# EAGLE design EEZ AUX PS r4B40 (EAGLE 6.1)
Assembly variants: Farnell, TME
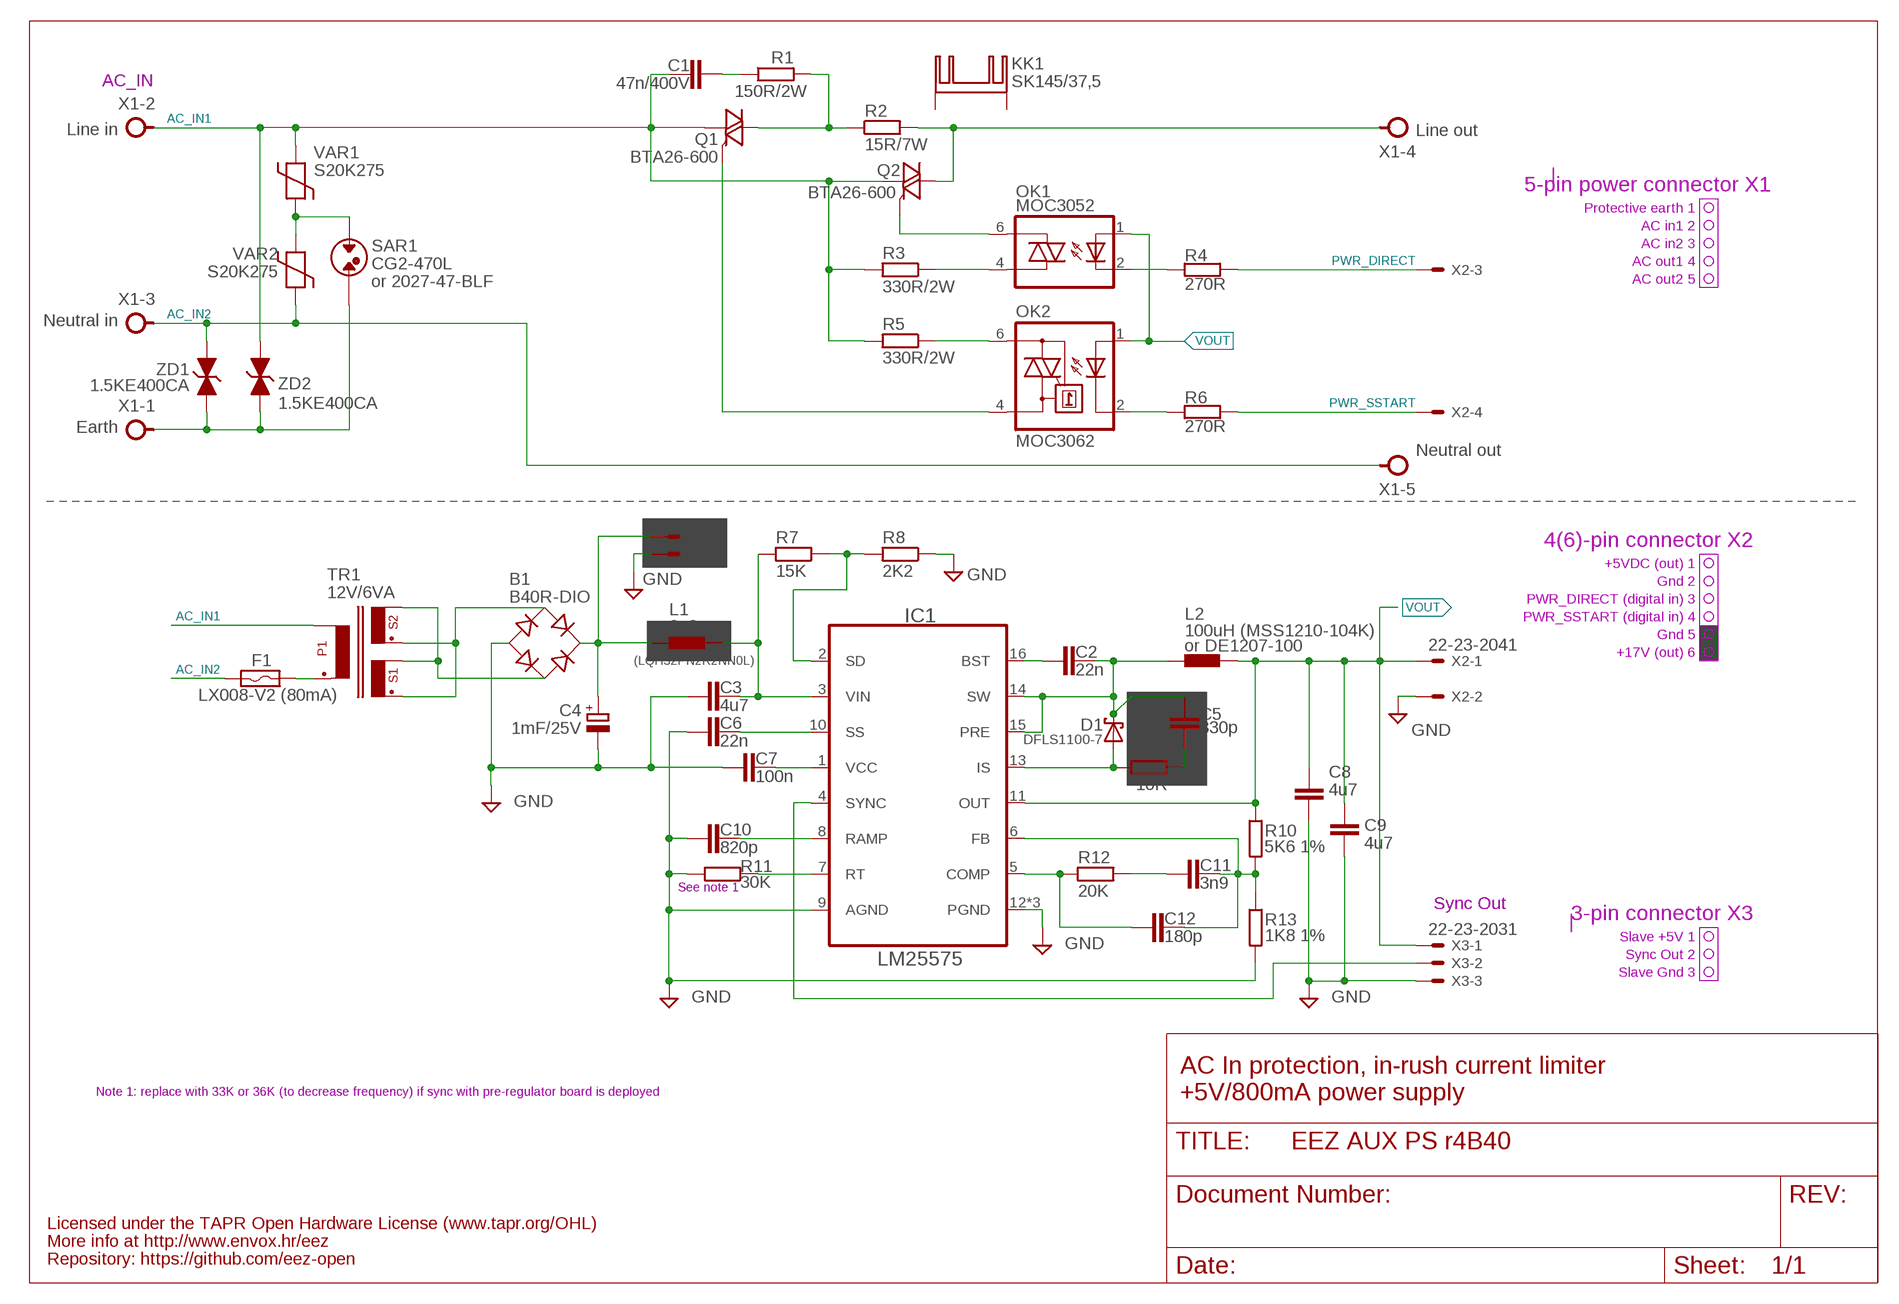
[diagram p0: schematic, sheet 1]

## Parts
B1  B40R-DIO  RECTIFIER-RB1A  [RB1A]
C1  47n/400V  C-EU075-052X106  [C075-052X106]
C2  22n  C-EUC0805  [C0805]
C3  4u7  C-EUC1210  [C1210]
C4  1mF/25V  ECAP5G_10.5MM  [ECAP5/10.5]
C5  330p  C-EUC0805  [C0805]
C6  22n  C-EUC0805  [C0805]
C7  100n  C-EUC0805  [C0805]
C8  4u7  C-EUC1210  [C1210]
C9  4u7  C-EUC1210  [C1210]
C10  820p  C-EUC0805  [C0805]
C11  3n9  C-EUC0805  [C0805]
C12  180p  C-EUC0805  [C0805]
D1  DFLS1100-7  SCHOTTKYSOD123  [SOD123]
F1  LX008-V2 (80mA)  FUSE_RESETTABLER7  [POLYSWITCH-R7]
IC1  LM25575  LM(2)5575  [SOP65P640X110-17N_HOLE]
KK1  SK145/37,5  SK145  [SK145]
L1  2u2  L1210  [L1210]
L2  100uH (MSS1210-104K)  COILCRAFT_MSS1278  [MSS1278]
OK1  MOC3052  MOC305X  [DIL6-SMD]
OK2  MOC3062  MOC3033S  [DIL6-SMD]
Q1  BTA26-600  BTA26-V  [TOP3S-1]
Q2  BTA26-600  BTA26-V  [TOP3S-1]
R1  150R/2W  R-EU_R2512  [R2512]
R2  15R/7W  R_EU7W  [R_0913]
R3  330R/2W  R-EU_R2512  [R2512]
R4  270R  R-EU_R0805  [R0805]
R5  330R/2W  R-EU_R2512  [R2512]
R6  270R  R-EU_R0805  [R0805]
R7  15K  R-EU_R0805  [R0805]
R8  2K2  R-EU_R0805  [R0805]
R9  10R  R-EU_R1206  [R1206]
R10  5K6 1%  R-EU_R0805  [R0805]
R11  30K  R-EU_R0805  [R0805]
R12  20K  R-EU_R0805  [R0805]
R13  1K8 1%  R-EU_R0805  [R0805]
SAR1  CG2-470L  SAR  [SAR]
TR1  12V/6VA  PCB_TRAFO6VACOMBO  [PCB_TRAFO6VA_DUAL]
VAR1  S20K275  VARISTOR  [VARISTOR]
VAR2  S20K275  VARISTOR  [VARISTOR]
X1  AC_IN  TBLOCK5.0_5A  [TBLOCK5.0_5]
X2  22-23-2041  22-23-2061  [22-23-2061]
X3  22-23-2031  [22-23-2031]
ZD1  1.5KE400CA  1.5KE-BIDIR  [DO201-BIDIR]
ZD2  1.5KE400CA  1.5KE-BIDIR  [DO201-BIDIR]

## Nets
AC_EARTH: SAR1.P$2 X1.1 ZD1.C ZD2.C
AC_IN1: C1.2 Q1.A1 Q2.A1 R3.2 R5.2 TR1.NC1(P1) TR1.P1 TR1.P1.1(P1) TR1.P1.2(P1) VAR1.P$2 X1.2 ZD2.A
AC_IN2: F1.P$1 VAR2.P$1 X1.3 X1.5 ZD1.A
DC_PREG1: C3.1 IC1.3(VIN) L1.2 R7.2
GND [gnd]: B1.- C3.2 C4.- C6.2 C7.1 C8.2 C9.2 C10.1 IC1.9(AGND) IC1.12(PGND) IC1.TP2(PGND) IC1.TP(PGND) R8.1 R11.2 R13.2 X2.2 X2.5 X3.3
IS: D1.A IC1.13(IS) R9.1
N$1: C5.2 R9.2
N$2: OK1.6(A2) Q2.G
N$3: OK1.4(A1) R3.1
N$4: OK2.4(A1) Q1.G
N$5: OK1.2(C) R4.1
N$6: OK2.2(C) R6.1
N$7: OK2.6(A2) R5.1
N$8: Q2.A2 R2.2 X1.4
N$13: IC1.4(SYNC) X3.2
N$15: C1.1 R1.1
N$16: Q1.A2 R1.2 R2.1
N$40: B1.AC2 TR1.S1.2 TR1.S1.2A(S1.2) TR1.S1.2NC(S1.2) TR1.S2.2
N$77: C11.2 R12.2
N$114: SAR1.P$1 VAR1.P$1 VAR2.P$2
N$128: C11.1 C12.1 IC1.6(FB) R10.2 R13.1
N$131: C2.2 IC1.16(BST)
N$135: C12.2 IC1.5(COMP) R12.1
N$141: B1.AC1 TR1.S1.1 TR1.S2.1 TR1.S2.1A(S2.1)
N$162: F1.P$2 TR1.P2 TR1.P2.1(P2) TR1.P2.2(P2)
N$165: IC1.7(RT) R11.1
N$166: C7.2 IC1.1(VCC)
N$167: C10.2 IC1.8(RAMP)
N$168: C6.1 IC1.10(SS)
N$180: IC1.2(SD) R7.1 R8.2
PWR_DIRECT: R4.2 X2.3
PWR_SSTART: R6.2 X2.4
SW: C2.1 C5.1 D1.C IC1.14(SW) IC1.15(PRE) L2.1
VIN: B1.+ C4.+ L1.1 X2.6
VOUT: C8.1 C9.1 IC1.11(OUT) L2.2 OK1.1(A) OK2.1(A) R10.1 X2.1 X3.1
Unconnected: KK1.1(K) KK1.2(K)

## Notes on the sheet
- Line in
- Line out
- 5-pin power connector X1
- Protective earth 1
- AC in1 2
- AC in2 3
- AC out1 4
- AC out2 5
- or 2027-47-BLF
- Neutral in
- Earth
- Neutral out
- 4(6)-pin connector X2
- +5VDC (out) 1
- Gnd 2
- PWR_DIRECT (digital in) 3
- PWR_SSTART (digital in) 4
- Gnd 5
- +17V (out) 6
- or DE1207-100
- (LQH32PN2R2NN0L)
- See note 1
- Sync Out | 3-pin connector X3
- Slave +5V 1
- Sync Out 2
- Slave Gnd 3
- AC In protection, in-rush current limiter
- Note 1: replace with 33K or 36K (to decrease frequency) if sync with pre-regulator board is deployed
- +5V/800mA power supply
- Licensed under the TAPR Open Hardware License (www.tapr.org/OHL)
- More info at http://www.envox.hr/eez
- Repository: https://github.com/eez-open

## Library data of the parts
B1 = rectifier:RECTIFIER-: Rectifier
C1-C3 C5-C12 = rcl:C-EU: CAPACITOR, European symbol
C4 = EEZ_Lib1:ECAP
D1 = EEZ_Lib1:SCHOTTKY
F1 = EEZ_Lib1:FUSE_RESETTABLE
IC1 = EEZ_Lib1:LM(2)5575: Simple Switcher® 42V, 1.5A Step-Down Switching Regulator
KK1 = EEZ_Lib1:SK145: FISCHER ELEKTRONIK SK 145/37,5 STS-220 Heat Sink, TO-220, TO-218, TO-220, TO-247, TO-248, 12 °C/W, 29 mm, 12 mm
L1 = EEZ_Lib1:L1210
L2 = EEZ_Lib1:COILCRAFT_MSS1278: Coilcraft SMT Power Inductors – MSS1278
OK1 = EEZ_Lib1:MOC305X: 6-pin DIP Random-phase Optoisolators Triac Drivers (600V Peak)
OK2 = optocoupler:MOC30*: 6-Pin DIP Zero-Cross Optoisolators Triac Driver Output (250/400 Volt Peak) Source: http://www.fairchildsemi.com/ds/MO/MOC3043-M.pdf; MF: FAIRCHILD SEMICONDUCTOR; MPN: MOC3033S-M; OC_FARNELL: unknown; OC_NEWARK: 05C2878
Q1 Q2 = triac:BTA26: 25A TRIAC Source: http://www.st.com/stonline/products/literature/ds/7470.pdf
R1 R3-R13 = rcl:R-EU_: RESISTOR, European symbol
R2 = EEZ_Lib1:R_EU: RESISTOR - European symbol
SAR1 = EEZ_Lib1:SAR: EPCOS surge arrester EF470X Farnell: 1886596
TR1 = EEZ_Lib1:PCB_TRAFO6VA: TEZ 6VA transformer for PCB
VAR1 VAR2 = MyLib:VARISTOR: EPCOS - B72220S0251K101 - VARISTOR, 140J, 250VAC Farnell: 1004357
X1 = EEZ_Lib1:TBLOCK5.0_5A
X2 = con-molex:22-23-2061: .100" (2.54mm) Center Header - 6 Pin; MF: MOLEX; MPN: 22-23-2061; OC_FARNELL: 1462922; OC_NEWARK: 27C1933
X3 = con-molex:22-23-2031: .100" (2.54mm) Center Header - 3 Pin; MF: MOLEX; MPN: 22-23-2031; OC_FARNELL: 1462950; OC_NEWARK: 30C0862
ZD1 ZD2 = EEZ_Lib1:1.5KE-BIDIR

## Net classes
0 default: width 0.254 mm, drill 0.584 mm
2 gnd: width 0.254 mm, drill 0.584 mm, clearance 0.254 mm

## Board
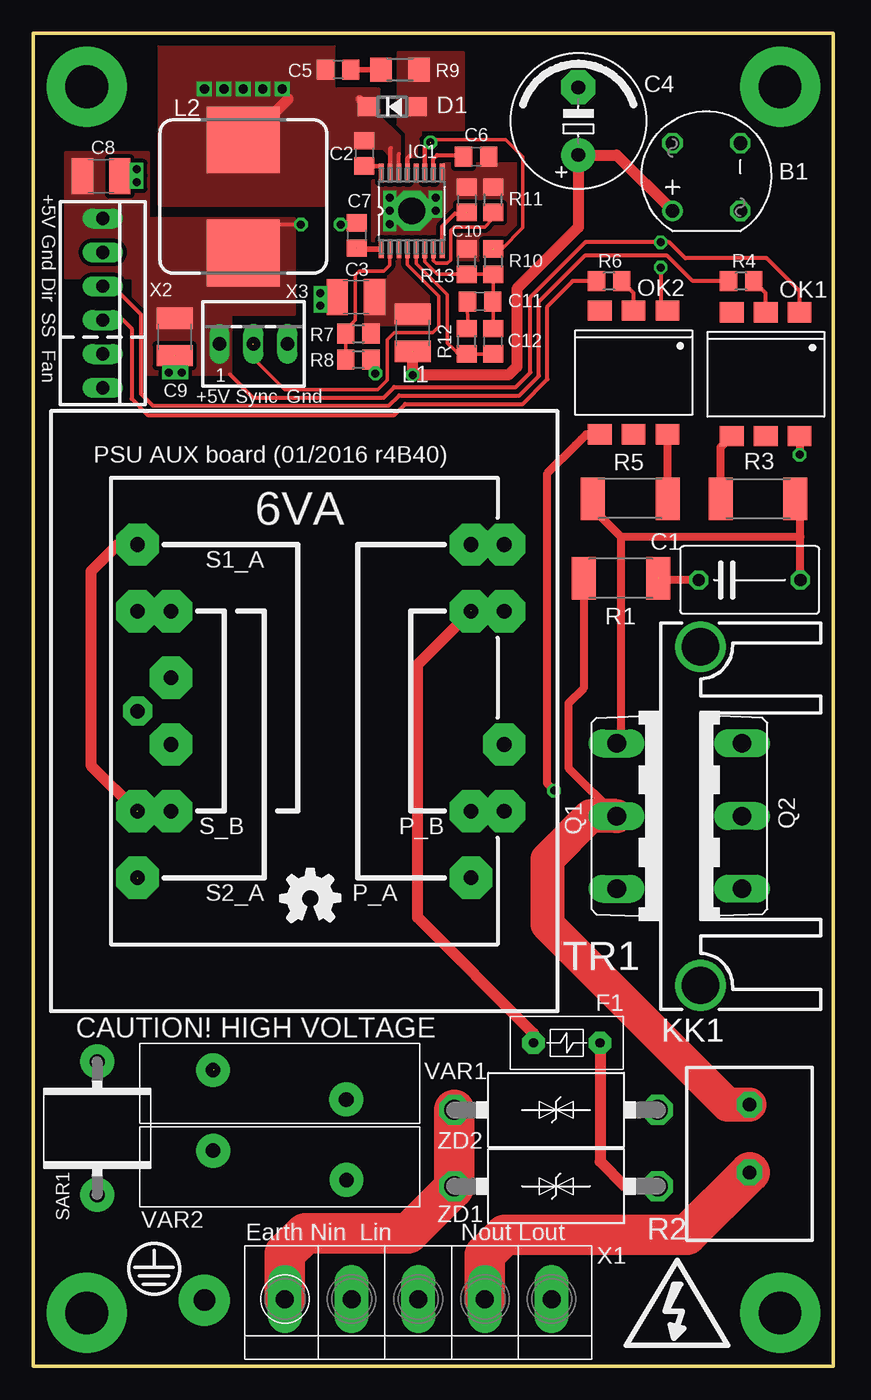
[diagram p1: board, top side]
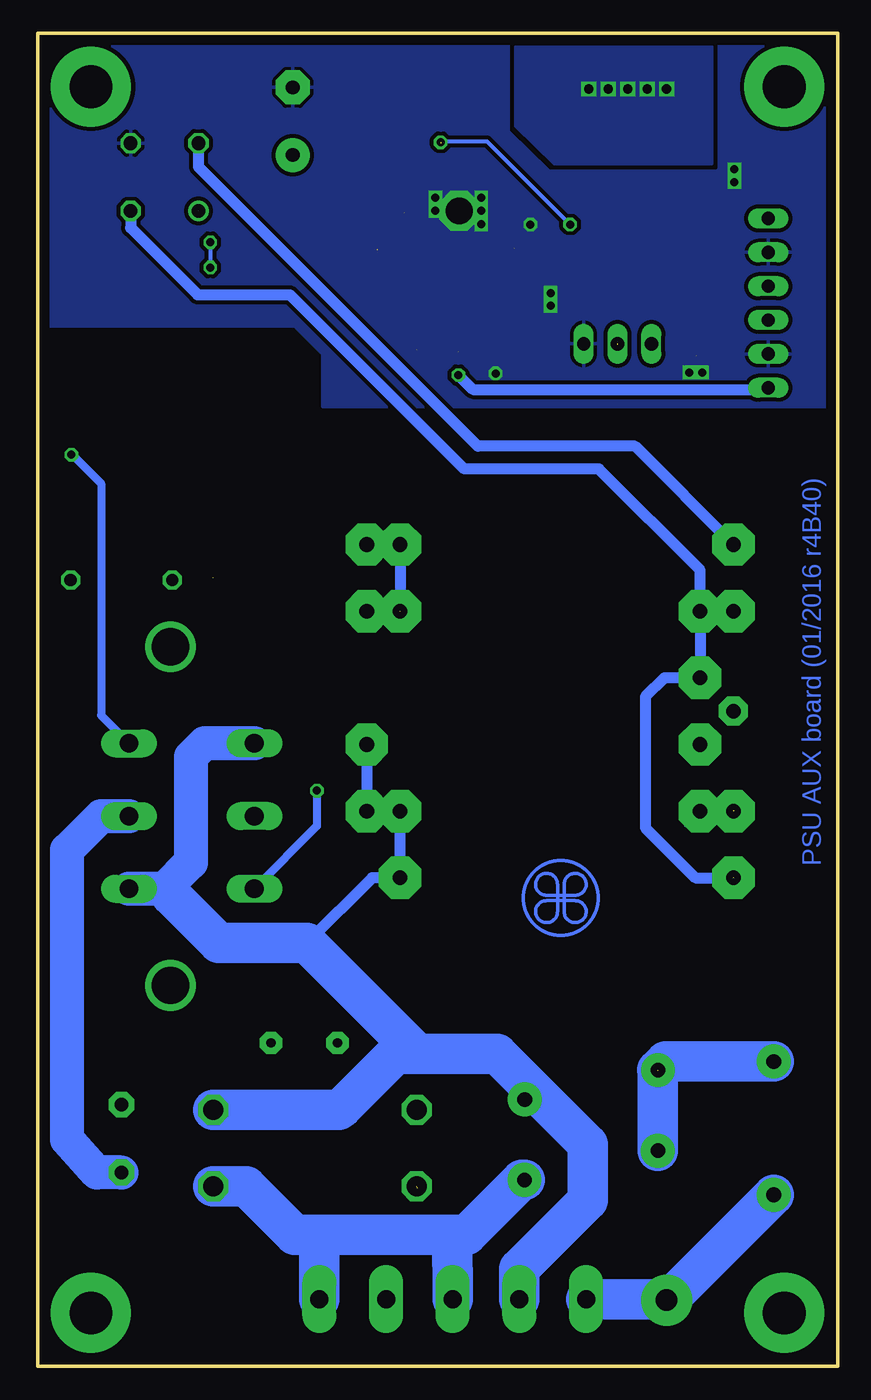
[diagram p2: board, bottom side, seen from below]

Size 60 x 100 mm. Coordinates in mm from the lower left corner, seen from the top.
Outline: 0,0 0,100 60,100 60,0 0,0
Copper layers (1+5*16): Top 0.035mm / dielectric 0.75mm / Route5 0.035mm / dielectric 0.75mm / Bottom 0.035mm
Design rules: minimum track width 10mil, minimum drill 0.5mm, track to track 8mil, track to pad 8mil, pad to pad 8mil, via to via 8mil, smd to smd 8mil, copper to edge 30mil, drill to drill 8mil, minimum pad ring 10mil, minimum via ring 8mil, stop-mask expansion 0mil, vias tented up to drill 25mil, thermal gap 10mil

### Footprints (pad centres in the part's own frame; a part is rotated, then mirrored left to right if it is on the bottom)
RB1A = drill 1.016: + -2.54,2.54 | drill 1.016 octagon: - 2.54,-2.54; AC1 2.54,2.54; AC2 -2.54,-2.54
C075-052X106 = drill 0.914 octagon: 1 -3.81,0; 2 3.81,0
C0805 = smd 1.3 x 1.5: 1 -0.95,0; 2 0.95,0
C1210 = smd 1.6 x 2.7: 1 -1.4,0; 2 1.4,0
ECAP5/10.5 = drill 1.016 pad 2.54: + -2.54,0 | drill 1.016 pad 2.54 octagon: - 2.54,0
SOD123 = smd 1.4 x 1.4: A 1.9,0; C -1.9,0
POLYSWITCH-R7 = drill 0.7 pad 1.676 octagon: P$1 -2.5,0; P$2 2.5,0
SOP65P640X110-17N_HOLE = smd 1.422 x 0.356: 1 -2.845,2.286; 2 -2.845,1.626; 3 -2.845,0.965; 4 -2.845,0.33; 5 -2.845,-0.33; 6 -2.845,-0.965; 7 -2.845,-1.626; 8 -2.845,-2.286; 9 2.845,-2.286; 10 2.845,-1.626; 11 2.845,-0.965; 12 2.845,-0.33; 13 2.845,0.33; 14 2.845,0.965; 15 2.845,1.626; 16 2.845,2.286 | smd 2.032 x 2.032: TP 0,0 | drill 2 octagon: TP2 0,0
SK145 = drill 2.8: 1 -12.7,0; 2 12.7,0
L1210 = smd 1.6 x 2.7: 1 -1.4,0; 2 1.4,0
MSS1278 = smd 5.5 x 5: 1 0,4.25; 2 0,-4.25
DIL6-SMD = smd 1.78 x 1.52: 1 -2.54,-4.645; 2 0,-4.645; 3 2.54,-4.645; 4 2.54,4.645; 5 0,4.645; 6 -2.54,4.645
TOP3S-1 = drill 1.397 long: A1 -5.461,-3.175; A2 0,-3.175; G 5.461,-3.175
R2512 = smd 1.8 x 3.2: 1 -2.8,0; 2 2.8,0
R_0913 = drill 1.016 pad 1.93 octagon: 1 -3.556,0; 2 1.524,0
R0805 = smd 1.3 x 1.5: 1 -0.95,0; 2 0.95,0
R1206 = smd 1.6 x 1.803: 1 -1.422,0; 2 1.422,0
SAR = drill 1.1 pad 2.54: P$1 0,0; P$2 10,0
PCB_TRAFO6VA_DUAL = drill 1.1 pad 3.175 octagon: NC1 -15,2.5; NC2 -15,-12.5; NC4 10,2.5; P1 -12.5,12.5; P1.1 -12.5,7.5; P1.2 -15,7.5; P2 -12.5,-12.5; P2.1 -12.5,-7.5; P2.2 -15,-7.5; S1.1 12.5,-12.5; S1.2 12.5,-7.5; S1.2A 10,-2.5; S1.2NC 10,-7.5; S2.1 12.5,7.5; S2.1A 10,7.5; S2.2 12.5,12.5 | drill 1.1 pad 2.184 octagon: NC3 12.5,0
VARISTOR = drill 1.1 pad 2.54: P$1 0,0; P$2 10,-2.2
TBLOCK5.0_5 = drill 1.35 pad 2.54 long: 1 0,0; 2 0,-5; 3 0,-10; 4 0,-15; 5 0,-20
22-23-2061 = drill 1 long: 1 -6.35,0; 2 -3.81,0; 3 -1.27,0; 4 1.27,0; 5 3.81,0; 6 6.35,0
22-23-2031 = drill 1 long: 1 -2.54,0; 2 0,0; 3 2.54,0
DO201-BIDIR = drill 1.499 octagon: A 7.62,0; C -7.62,0

### Placement (x,y rotation side)
B1  50.48,89.22 90 top
C1  53.72,58.99 0 top
C2  24.83,91 270 top
C3  24.19,80.2 180 top
C4  40.87,93.41 90 top
C5  22.86,97.28 0 top
C6  33.21,90.74 0 top
C7  24.26,84.84 270 top
C8  5.08,89.28 0 top
C9  10.6,77.22 270 top
C10  32.51,87.5 270 top
C11  33.5,79.88 180 top
C12  34.48,76.9 270 top
D1  26.92,94.49 0 top
EEZ_SIGNATURE  SIGNATURESMALL  [SIGNATURE_5MM]  20.76,35.13 180 top
F1  40.01,24.26 180 top
IC1  28.38,86.68 90 top
KK1  50.04,41.27 270 top
L1  28.45,77.53 90 top
L2  100uH (MSS1260-104K)  [MSS1278]  15.75,87.76 0 top
OK1  54.93,74.42 180 top
OK2  45.02,74.55 180 top
Q1  46.93,41.27 270 top
Q2  49.97,41.27 90 top
R1  44.07,59.12 180 top
R2  53.72,16.07 270 top
R3  54.36,65.09 0 top
R4  53.09,81.41 180 top
R5  44.77,65.09 180 top
R6  43.18,81.41 180 top
R7  24.38,77.47 0 top
R8  24.38,75.5 180 top
R9  27.5,97.28 180 top
R10  34.48,82.87 270 top
R11  34.48,87.5 90 top
R12  32.51,76.9 90 top
R13  32.51,82.87 90 top
SAR1  4.79,22.86 270 top
TR1  20.32,49.15 180 top
VAR1  13.47,22.21 0 top
VAR2  23.49,13.97 180 top
X1  18.87,5.03 90 top
X2  5.21,79.76 270 top
X3  16.51,76.71 0 top
ZD1  39.21,13.5 0 top
ZD2  39.21,19.23 0 top

### Tracks (layer width: path | path; a pad name or v marks a point on that pad's centre or on a via)
AC_EARTH  (via drill 1.6 pad 3.81)  (1 unrouted)
  Top 3.048: ZD1.C ZD2.C | X1.1 18.87,8.46 20.38,9.97 28.13,9.97 31.5,13.34
  Bottom 3.048: X1.1 12.94,5.03 v12.83,4.95 12.7,4.95 SAR1.P$2
AC_IN1
  Top 0.61: C1.2 57.53,62.23 | 57.53,62.23 57.53,64.27 R3.2 | R5.2 41.97,64.33 44.07,62.23 | 44.07,62.23 57.53,62.23 | 44.07,62.23 44.07,47.05 Q1.A1
  Bottom 0.61: 37.4,19.24 37.34,19.24 37.21,19.37
  Bottom 0.813: TR1.NC1 TR1.P1.2 TR1.P1.1 TR1.P1 34.92,36.65 39.81,31.75 | 25.53,23.43 25.34,23.43 22.69,20.79 VAR1.P$2
  Bottom 2.54: Q1.A1 47.5,46.74 48.51,45.72 48.51,37.78 50.48,35.81 | 50.48,35.81 Q2.A1 | 31.62,23.56 31.75,23.43 | 50.48,35.81 49.97,35.31
  Bottom 3.048: X1.2 23.87,7.31 18.73,12.45 18.73,16.64 25.53,23.43 31.75,23.43 33.15,23.43 37.21,19.37 | 37.4,19.24 46.81,19.24 ZD2.A | 31.62,23.56 39.81,31.75 46.42,31.75 49.97,35.31
AC_IN2
  Top 0.813: 45.59,13.5 ZD1.A 44.36,13.5 42.51,15.35 F1.P$1
  Bottom 3.048: ZD1.A 44.36,13.5 40.7,9.84 38.86,9.84 | X1.5 38.87,9.83 38.86,9.84 | 28.89,9.84 27.81,9.84 23.69,13.97 VAR2.P$1 | 28.89,9.84 38.86,9.84 | X1.3 28.89,9.84
DC_PREG1
  pour Top (isolate 0.305, no thermals): 27.37,83.82 27.5,83.82 27.5,82.61 28,82.11 29.21,80.96 29.65,80.58 29.65,78.11 24.89,78.11 24.89,81.53 26.61,81.53 26.61,82.87 27.37,82.87
GND  (via drill 0.6)  (1 unrouted)
  Top 0.254: v21.53,80.52 22.48,80.52 C3.2 | v25.65,74.49 R8.1
  Top 0.305: C7.1 v23.05,85.66 | v10.16,74.55 10.1,75.31 C9.2 | v7.75,88.84 6.99,88.77 C8.2
  other vias: 11.11,74.55 7.75,89.79 26.73,87.68 26.73,86.68 26.73,85.67 21.53,79.57 30.16,87.68 30.16,86.68
  pour Bottom (isolate 0.305, rank 2): 0.51,99.63 59.88,99.63 59.88,78.04 40.7,78.04 38.61,75.95 38.61,72.01 0.51,72.01
  pour Top (isolate 0.305, no thermals): 25.46,88.9 30.8,88.9 30.8,90.17 36.26,90.17 36.26,82.99 31.69,82.99 31.69,84.45 25.46,84.45
IS
  Top 0.356: IC1.13 28.05,90.6 28.26,90.81
  pour Top (isolate 0.305, no thermals): 28,89.79 28,92.52 27.37,93.15 27.37,98.55 32.26,98.55 32.26,92.77 29.02,92.77 29.02,90.74 28.26,90.74 28.13,90.61 28.13,89.79
N$1
  Top 0.406: C5.2 R9.2
N$2  (via drill 0.6)
  Top 0.61: OK1.6 v57.47,68.39
  Bottom 0.61: v57.47,68.39 57.4,68.39 55.24,66.23 55.24,48.83 Q2.G
N$3
  Top 0.508: 52.32,69.71 OK1.4
  Top 0.61: R3.1 51.56,68.94 OK1.4
N$4  (via drill 0.6)
  Top 0.61: v39.05,43.18 38.54,43.69 38.54,66.99 40.67,69.12 41.08,69.53 41.46,69.9 OK2.4
  Bottom 0.61: v39.05,43.18 39.05,40.51 Q1.G
N$5
  Top 0.305: OK1.2 54.93,80.52 R4.1
N$6
  Top 0.305: OK2.2 45.02,80.52 R6.1
N$7
  Top 0.61: R5.1 OK2.6
N$8
  Top 3.048: X1.4 33.87,8.34 35.37,9.84 49.02,9.84 R2.2
  Bottom 2.54: R2.2 55.56,14.54 57.78,17.02 57.78,38.73 55.24,41.27 Q2.A2
N$13  (1 unrouted)
  Top 0.254: 28.07,83.83 IC1.4 28.05,82.63 30.42,80.26 30.42,77.98 29.97,77.53 27.05,77.53 26.54,77.03 26.54,73.98 25.84,73.28 18.86,73.28 16.51,75.63 16.51,76.64
N$15  (1 unrouted)
  Top 0.61: C1.1 46.67,58.99 | 46.61,58.99 46.67,58.99 | 46.67,58.99 46.86,59.18
N$16
  Top 0.61: R1.2 41.27,50.86 40.13,49.72 40.13,44.9 Q1.A2
  Top 2.54: Q1.A2 41.78,41.27 38.54,38.04 38.54,33.15 52.07,19.62 R2.1
N$40  (1 unrouted)
  Bottom 0.813: TR1.S1.2 TR1.S1.2NC | TR1.S1.2NC TR1.S1.2A 12.99,51.65 14.41,50.23 14.41,40.39 10.67,36.64 TR1.S2.2 | TR1.S2.2 | TR1.S1.2NC 10.32,59.72 17.91,67.31 28,67.31 41.08,80.39 48.01,80.39 53.02,85.41 B1.AC2
N$77
  Top 0.254: C11.2 32.58,78.04 R12.2
N$114  (1 unrouted)
  Bottom 3.048: SAR1.P$1 12.88,22.87 13.53,22.23 | VAR2.P$2 13.49,22.2 VAR1.P$1
N$128
  Top 0.254: IC1.6 29.35,82.86 30.29,81.92 R13.1 R10.2 34.48,80.08 C11.1 34.48,79.94 C12.1
N$131
  Top 0.356: C2.2 26.03,90.05 26.1,89.98 IC1.16
N$135  (1 unrouted)
  Top 0.254: IC1.5 28.71,82.73 31.05,80.39 31.05,76.77 31.56,76.27 | C12.2 R12.1 31.88,75.95 31.56,76.26
N$141  (1 unrouted)
  Top 0.813: TR1.S1.1 6.34,61.65 4.32,59.63 4.32,45.09 7.75,41.66
  Bottom 0.813: TR1.S2.1 TR1.S2.1A 11.18,40.79 | TR1.S1.1 15.2,69.03 26.99,69.03 47.94,89.98 B1.AC1
N$162  (1 unrouted)
  Top 0.813: F1.P$2 37.51,24.98 28.83,33.66 28.83,52.64 TR1.P2.1
  Bottom 0.813: TR1.P2 TR1.P2.1 TR1.P2.2
N$165
  Top 0.254: IC1.7 30.01,82.96 30.23,82.74 31.05,82.74 31.3,83 31.3,85.22 31.56,85.47 33.85,85.47 34.42,86.04 R11.1
N$166  (1 unrouted)
  Top 0.356: IC1.1 25.92,83.83 25.91,83.82
  Top 0.406: 25.91,83.82 24.32,83.82 C7.2
N$167  (1 unrouted)
  Top 0.305: IC1.8 30.67,85.53 31.62,86.49 32.45,86.49 C10.2
N$168
  Top 0.305: IC1.10 30.01,90.59 30.29,90.87 32.13,90.87 C6.1
N$180
  Top 0.254: IC1.2 26.73,83.83 | 26.73,83.83 26.73,83.88 | 26.73,83.83 26.73,82.61 26.29,82.17 24.45,82.17 24.13,81.85 24.13,78.49 23.43,77.79 R7.1 R8.2
PWR_DIRECT
  Top 0.305: R4.2 49.47,81.41 47.56,83.31 41.34,83.31 37.91,79.88 37.91,74.3 36.45,72.83 27.43,72.83 26.67,72.07 8.95,72.07 8.06,72.96 8.06,78.93 5.97,81.03 X2.3
PWR_SSTART
  Top 0.305: R6.2 40.45,81.41 38.54,79.5 38.54,74.04 36.7,72.2 27.88,72.2 27.05,71.37 8.57,71.37 7.37,72.58 7.37,77.85 6.73,78.49 X2.4
SW  (via drill 0.7)
  Top 0.305: IC1.14 27.42,90.94
  Top 0.356: IC1.15 26.76,91.34 26.8,91.38
  Top 0.61: 25.72,94.17 24.45,95.06
  Top 0.813: L2.1 16.06,92.01 19.11,95.06
  other vias: 18.67,95.82 17.21,95.82 15.75,95.82 14.29,95.82 12.83,95.82
  pour Top (isolate 0.305, no thermals): 9.46,87.12 9.46,99.12 10.92,99.12 19.88,99.19 22.54,99.19 22.54,95.82 25.91,95.82 25.91,93.79 27.43,92.27 27.43,90.93 27.37,90.87 27.37,88.96 26.73,88.96 26.73,90.87 26.23,91.38 22.1,91.38 21.78,91.06 21.78,87.12
  pour Bottom (no thermals): 9.46,99 9.46,90.23 21.27,90.23 24.13,93.03 24.13,99
TA1  (via drill 3.2 pad 6)
  other vias: 4,96
TA2  (via drill 3.2 pad 6)
  other vias: 56,96
TA3  (via drill 3.2 pad 6)
  other vias: 4,4
TA4  (via drill 3.2 pad 6)
  other vias: 56,4
VIN  (via drill 0.6)  (2 unrouted)
  Top 0.813: B1.+ 43.75,90.87 C4.+ 40.87,85.45 36.26,80.83 36.26,74.99 35.62,74.36 v28.45,74.36 L1.1
  Bottom 0.813: X2.6 5.33,73.28 27.37,73.28 v28.45,74.36
VOUT  (via drill 0.6)  (2 unrouted)
  Top 0.254: 29.78,91.76 30.04,92.01 35.43,92.01 36.7,90.74 36.7,85.41 35.12,83.82 34.61,83.82 34.54,83.76
  Top 0.305: 13.97,81.98 13.91,82.04 14.41,82.04 15.81,83.44 | 15.81,83.44 15.88,83.5 | L2.2 15.81,83.44 | v20.07,85.66 18.1,85.66 15.94,83.5 | v47.05,82.42 47.05,79.7 OK2.1 | OK1.1 57.47,80.64 54.99,83.12 48.9,83.12 47.69,84.33 v47.05,84.33 41.4,84.33 37.27,80.2 37.27,74.55 36.2,73.47 27.05,73.47 26.23,72.64 16.51,72.64 14.73,74.42
  Top 0.356: IC1.11 29.35,91.39 v29.78,91.82
  Bottom 0.305: v20.07,85.66 26.29,91.89 29.72,91.89 v29.78,91.82 | v47.05,84.33 v47.05,82.42
  pour Top (isolate 0.305, no thermals): 2.41,81.66 2.41,91.06 8.64,91.06 8.64,86.11 19.56,86.11 19.56,78.93 14.8,78.93 14.8,74.42 7.49,74.42 7.49,81.66

### Text on the board
Bottom: PSU AUX board (01/2016 r4B40)
tPlace: +5V | Gnd | Dir | SS | Fan | +5V | Sync | Gnd | PSU AUX board (01/2016 r4B40) | CAUTION! HIGH VOLTAGE | Earth Nin Lin | Nout Lout
tDocu: Licensed under the TAPR Open Hardware License (www.tapr.org/OHL)
_tNames: C5 | R9 | C4 | L2 | D1 | C2 | C6 | C8 | IC1 | B1 | C7 | R11 | C10 | C3 | R13 | R10 | R6 | R4 | X2 | X3 | OK2 | OK1 | C11 | R7 | R8 | R12 | C12 | C9 | L1 | R5 | R3 | C1 | R1 | Q1 | Q2 | TR1 | F1 | KK1 | VAR1 | ZD2 | ZD1 | SAR1 | R2 | VAR2 | X1